# Altium project 20141106 smart car motor driver.PrjPCB
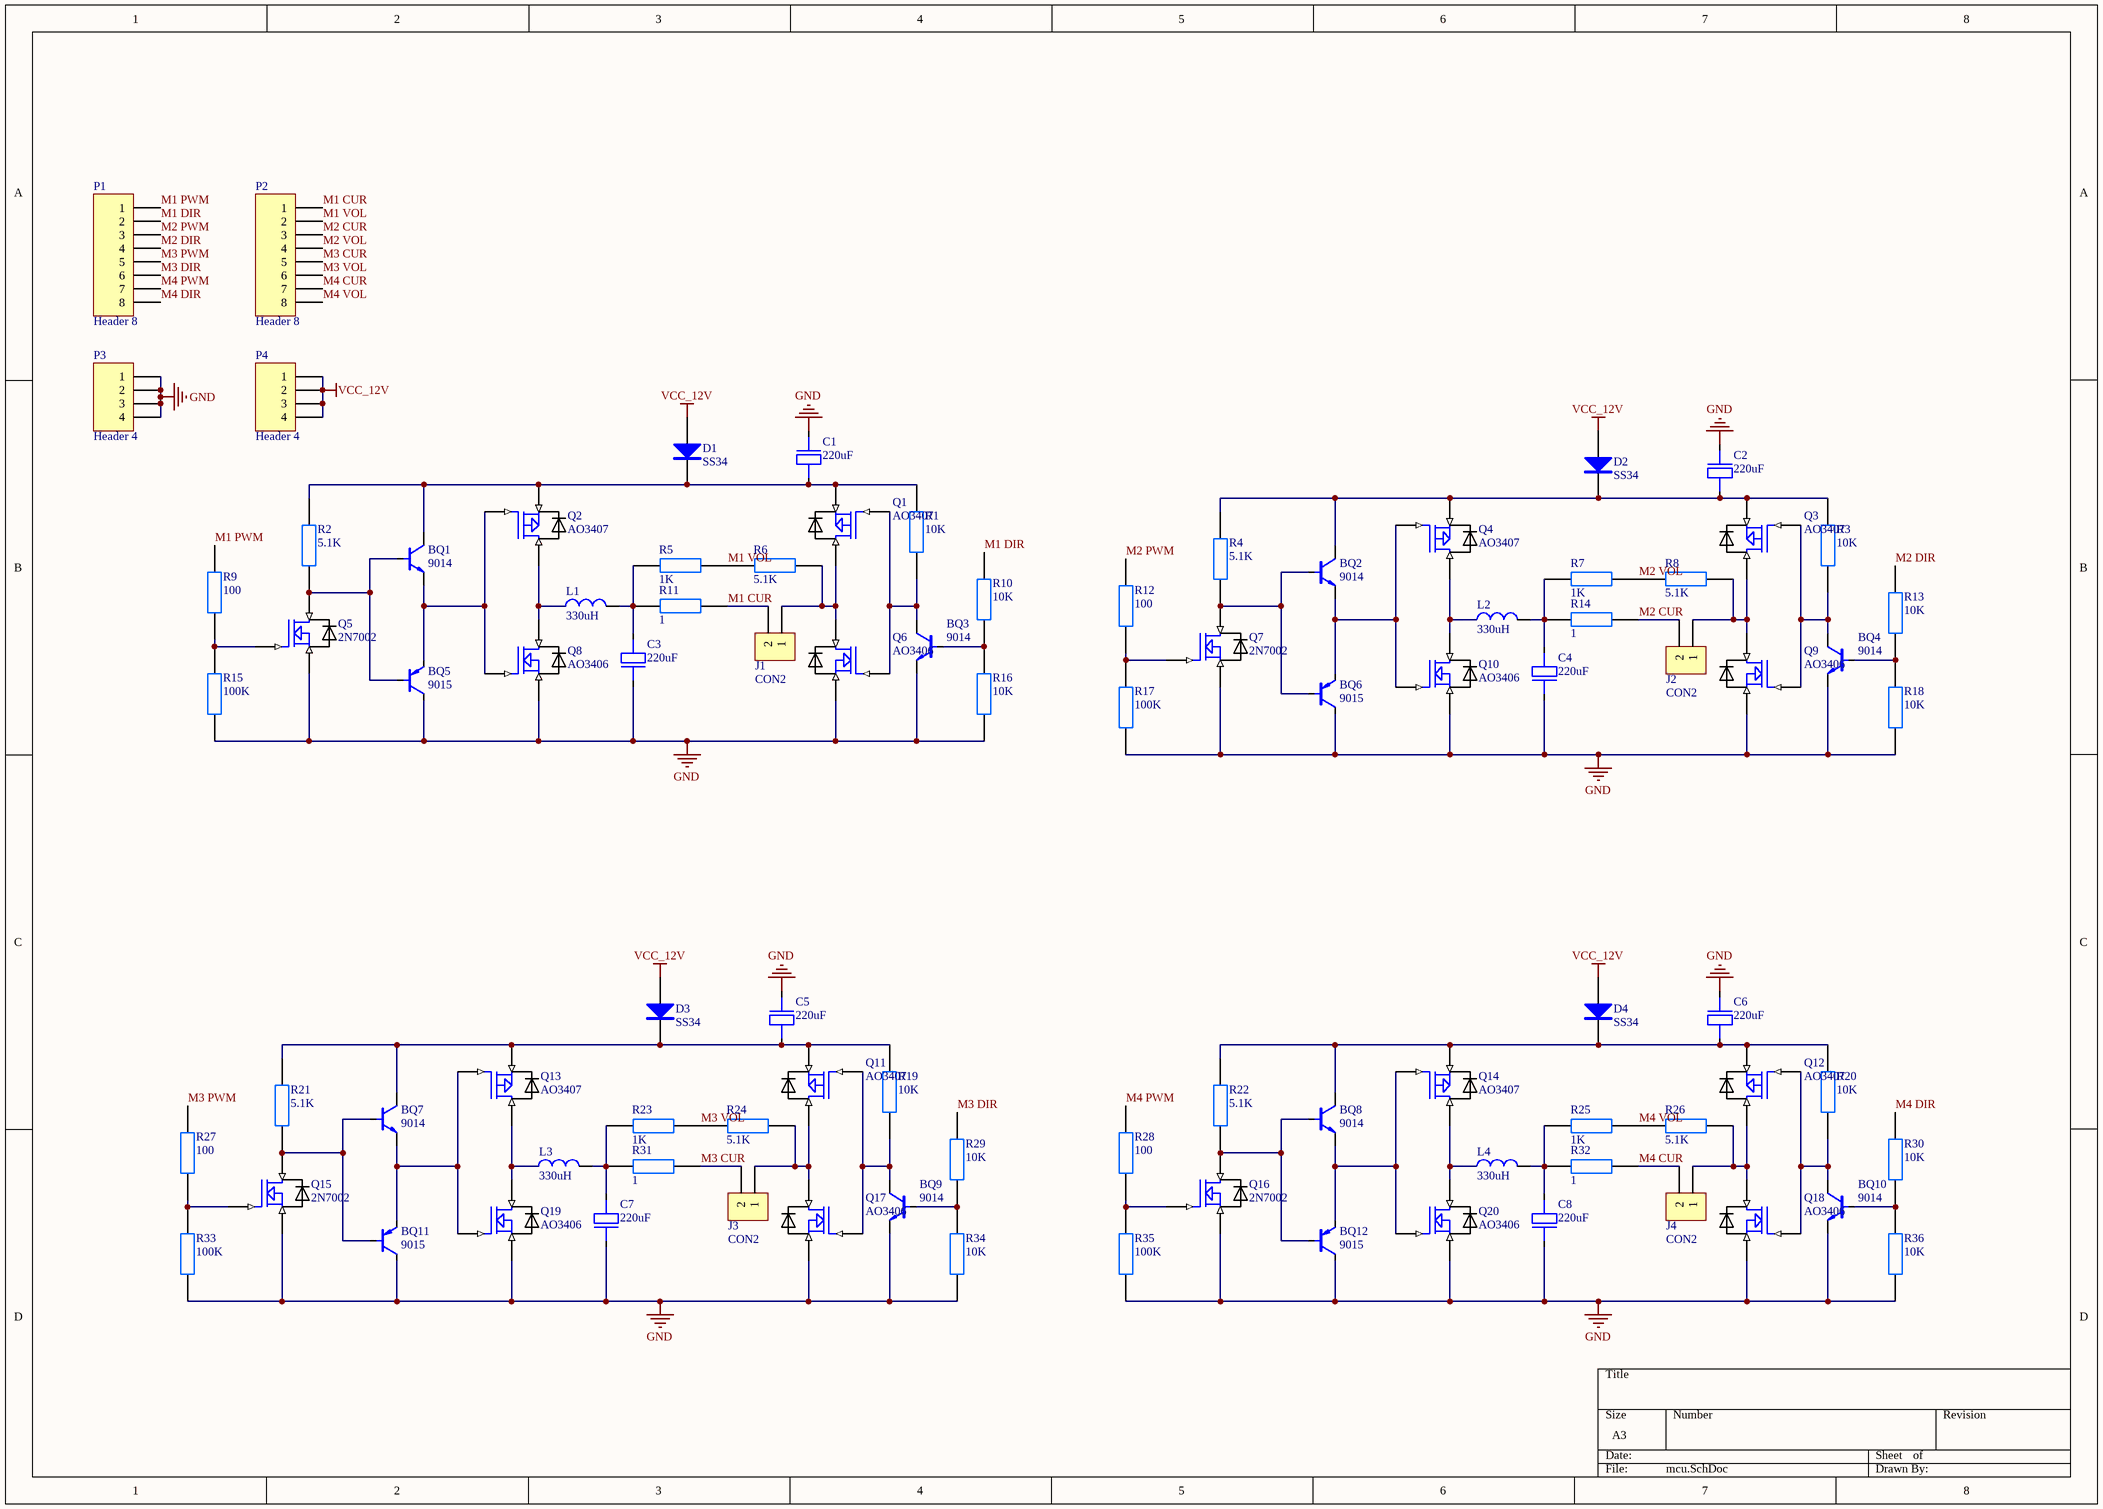
[diagram p0: mcu.SchDoc]
1 sheet, 92 parts. Net scope: global (net labels, ports and power ports of the same name join across sheets).
Board file: PCB1.PcbDoc

## Sheet mcu.SchDoc
size A3

### Parts
BQ1  9014  [SOT-23]
BQ2  9014  [SOT-23]
BQ3  9014  [SOT-23]
BQ4  9014  [SOT-23]
BQ5  9015  [SOT-23]
BQ6  9015  [SOT-23]
BQ7  9014  [SOT-23]
BQ8  9014  [SOT-23]
BQ9  9014  [SOT-23]
BQ10  9014  [SOT-23]
BQ11  9015  [SOT-23]
BQ12  9015  [SOT-23]
C1  220uF  [7443]
C2  220uF  [7443]
C3  220uF  [7443]
C4  220uF  [7443]
C5  220uF  [7443]
C6  220uF  [7443]
C7  220uF  [7443]
C8  220uF  [7443]
D1  SS34  [DO-241AC]
D2  SS34  [DO-241AC]
D3  SS34  [DO-241AC]
D4  SS34  [DO-241AC]
J1  CON2  [con2]
J2  CON2  [con2]
J3  CON2  [con2]
J4  CON2  [con2]
L1  330uH  [12x12]
L2  330uH  [12x12]
L3  330uH  [12x12]
L4  330uH  [12x12]
P1  Header 8  [sip8 N]
P2  Header 8  [sip8 N]
P3  Header 4  [sip4 N]
P4  Header 4  [sip4 N]
Q1  AO3407  [sot-23]
Q2  AO3407  [sot-23]
Q3  AO3407  [sot-23]
Q4  AO3407  [sot-23]
Q5  2N7002  [sot-23]
Q6  AO3406  [sot-23]
Q7  2N7002  [sot-23]
Q8  AO3406  [sot-23]
Q9  AO3406  [sot-23]
Q10  AO3406  [sot-23]
Q11  AO3407  [sot-23]
Q12  AO3407  [sot-23]
Q13  AO3407  [sot-23]
Q14  AO3407  [sot-23]
Q15  2N7002  [sot-23]
Q16  2N7002  [sot-23]
Q17  AO3406  [sot-23]
Q18  AO3406  [sot-23]
Q19  AO3406  [sot-23]
Q20  AO3406  [sot-23]
R1  10K  [0805]
R2  5.1K  [0805]
R3  10K  [0805]
R4  5.1K  [0805]
R5  1K  [0805]
R6  5.1K  [0805]
R7  1K  [0805]
R8  5.1K  [0805]
R9  100  [0805]
R10  10K  [0805]
R11  1  [2512]
R12  100  [0805]
R13  10K  [0805]
R14  1  [2512]
R15  100K  [0805]
R16  10K  [0805]
R17  100K  [0805]
R18  10K  [0805]
R19  10K  [0805]
R20  10K  [0805]
R21  5.1K  [0805]
R22  5.1K  [0805]
R23  1K  [0805]
R24  5.1K  [0805]
R25  1K  [0805]
R26  5.1K  [0805]
R27  100  [0805]
R28  100  [0805]
R29  10K  [0805]
R30  10K  [0805]
R31  1  [2512]
R32  1  [2512]
R33  100K  [0805]
R34  10K  [0805]
R35  100K  [0805]
R36  10K  [0805]

### Nets
GND: BQ3.e BQ4.e BQ5.c BQ6.c BQ9.e BQ10.e BQ11.c BQ12.c C1.2 C2.2 C3.2 C4.2 C5.2 C6.2 C7.2 C8.2 P3.1 P3.2 P3.3 P3.4 Q5.3(S) Q6.3(S) Q7.3(S) Q8.3(S) Q9.3(S) Q10.3(S) Q15.3(S) Q16.3(S) Q17.3(S) Q18.3(S) Q19.3(S) Q20.3(S) R15.1 R16.1 R17.1 R18.1 R33.1 R34.1 R35.1 R36.1
VCC_12V: D1.1(A) D2.1(A) D3.1(A) D4.1(A) P4.1 P4.2 P4.3 P4.4
M1 CUR: J1.2 P2.1 R11.2
M1 DIR: P1.2 R10.2
M1 PWM: P1.1 R9.2
M1 VOL: P2.2 R5.2 R6.1
M2 CUR: J2.2 P2.3 R14.2
M2 DIR: P1.4 R13.2
M2 PWM: P1.3 R12.2
M2 VOL: P2.4 R7.2 R8.1
M3 CUR: J3.2 P2.5 R31.2
M3 DIR: P1.6 R29.2
M3 PWM: P1.5 R27.2
M3 VOL: P2.6 R23.2 R24.1
M4 CUR: J4.2 P2.7 R32.2
M4 DIR: P1.8 R30.2
M4 PWM: P1.7 R28.2
M4 VOL: P2.8 R25.2 R26.1
NetBQ1_b: BQ1.b BQ5.b Q5.2(D) R2.1
NetBQ1_c: BQ1.c C1.1 D1.2(K) Q1.3(S) Q2.3(S) R1.2 R2.2
NetBQ1_e: BQ1.e BQ5.e Q2.1(G) Q8.1(G)
NetBQ2_b: BQ2.b BQ6.b Q7.2(D) R4.1
NetBQ2_c: BQ2.c C2.1 D2.2(K) Q3.3(S) Q4.3(S) R3.2 R4.2
NetBQ2_e: BQ2.e BQ6.e Q4.1(G) Q10.1(G)
NetBQ3_b: BQ3.b R10.1 R16.2
NetBQ3_c: BQ3.c Q1.1(G) Q6.1(G) R1.1
NetBQ4_b: BQ4.b R13.1 R18.2
NetBQ4_c: BQ4.c Q3.1(G) Q9.1(G) R3.1
NetBQ7_b: BQ7.b BQ11.b Q15.2(D) R21.1
NetBQ7_c: BQ7.c C5.1 D3.2(K) Q11.3(S) Q13.3(S) R19.2 R21.2
NetBQ7_e: BQ7.e BQ11.e Q13.1(G) Q19.1(G)
NetBQ8_b: BQ8.b BQ12.b Q16.2(D) R22.1
NetBQ8_c: BQ8.c C6.1 D4.2(K) Q12.3(S) Q14.3(S) R20.2 R22.2
NetBQ8_e: BQ8.e BQ12.e Q14.1(G) Q20.1(G)
NetBQ9_b: BQ9.b R29.1 R34.2
NetBQ9_c: BQ9.c Q11.1(G) Q17.1(G) R19.1
NetBQ10_b: BQ10.b R30.1 R36.2
NetBQ10_c: BQ10.c Q12.1(G) Q18.1(G) R20.1
NetC3_1: C3.1 L1.1 R5.1 R11.1
NetC4_1: C4.1 L2.1 R7.1 R14.1
NetC7_1: C7.1 L3.1 R23.1 R31.1
NetC8_1: C8.1 L4.1 R25.1 R32.1
NetJ1_1: J1.1 Q1.2(D) Q6.2(D) R6.2
NetJ2_1: J2.1 Q3.2(D) Q9.2(D) R8.2
NetJ3_1: J3.1 Q11.2(D) Q17.2(D) R24.2
NetJ4_1: J4.1 Q12.2(D) Q18.2(D) R26.2
NetL1_2: L1.2 Q2.2(D) Q8.2(D)
NetL2_2: L2.2 Q4.2(D) Q10.2(D)
NetL3_2: L3.2 Q13.2(D) Q19.2(D)
NetL4_2: L4.2 Q14.2(D) Q20.2(D)
NetQ5_1: Q5.1(G) R9.1 R15.2
NetQ7_1: Q7.1(G) R12.1 R17.2
NetQ15_1: Q15.1(G) R27.1 R33.2
NetQ16_1: Q16.1(G) R28.1 R35.2

### Library data of the parts
BQ1-BQ4 BQ7-BQ10 = 9014: transistor; pin to pad: b>1 c>3 e>2
BQ5 BQ6 BQ11 BQ12 = 9015: transistor; pin to pad: b>1 c>3 e>2
C1-C8 = Electrolytic CAP: VALUE: 220uF
D1-D4 = SS14: Diode
L1-L4 = Inductance: value: 330uH
P1 P2 = Header 8: Header, 8-Pin; LatestRevisionDate: 17-Jul-2002; LatestRevisionNote: Re-released for DXP Platform.; Publisher: Altium Limited
P3 P4 = Header 4: Header, 4-Pin; LatestRevisionDate: 17-Jul-2002; LatestRevisionNote: Re-released for DXP Platform.; Publisher: Altium Limited
Q1-Q4 Q11-Q14 = AO3407: pin to pad: 2>3 3>2
Q5 Q7 Q15 Q16 = 2N7002: pin to pad: 2>3 3>2
Q6 Q8-Q10 Q17-Q20 = AO3406: pin to pad: 2>3 3>2
R1-R36 = RES
  R1 R3 R10 R13 R16 R18-R20 R29 R30 R34 R36: VALUE: 10K
  R2 R4 R6 R8 R21 R22 R24 R26: VALUE: 5.1K
  R5 R7 R23 R25: VALUE: 1K
  R9 R12 R27 R28: VALUE: 100
  R11 R14 R31 R32: VALUE: 1
  R15 R17 R33 R35: VALUE: 100K